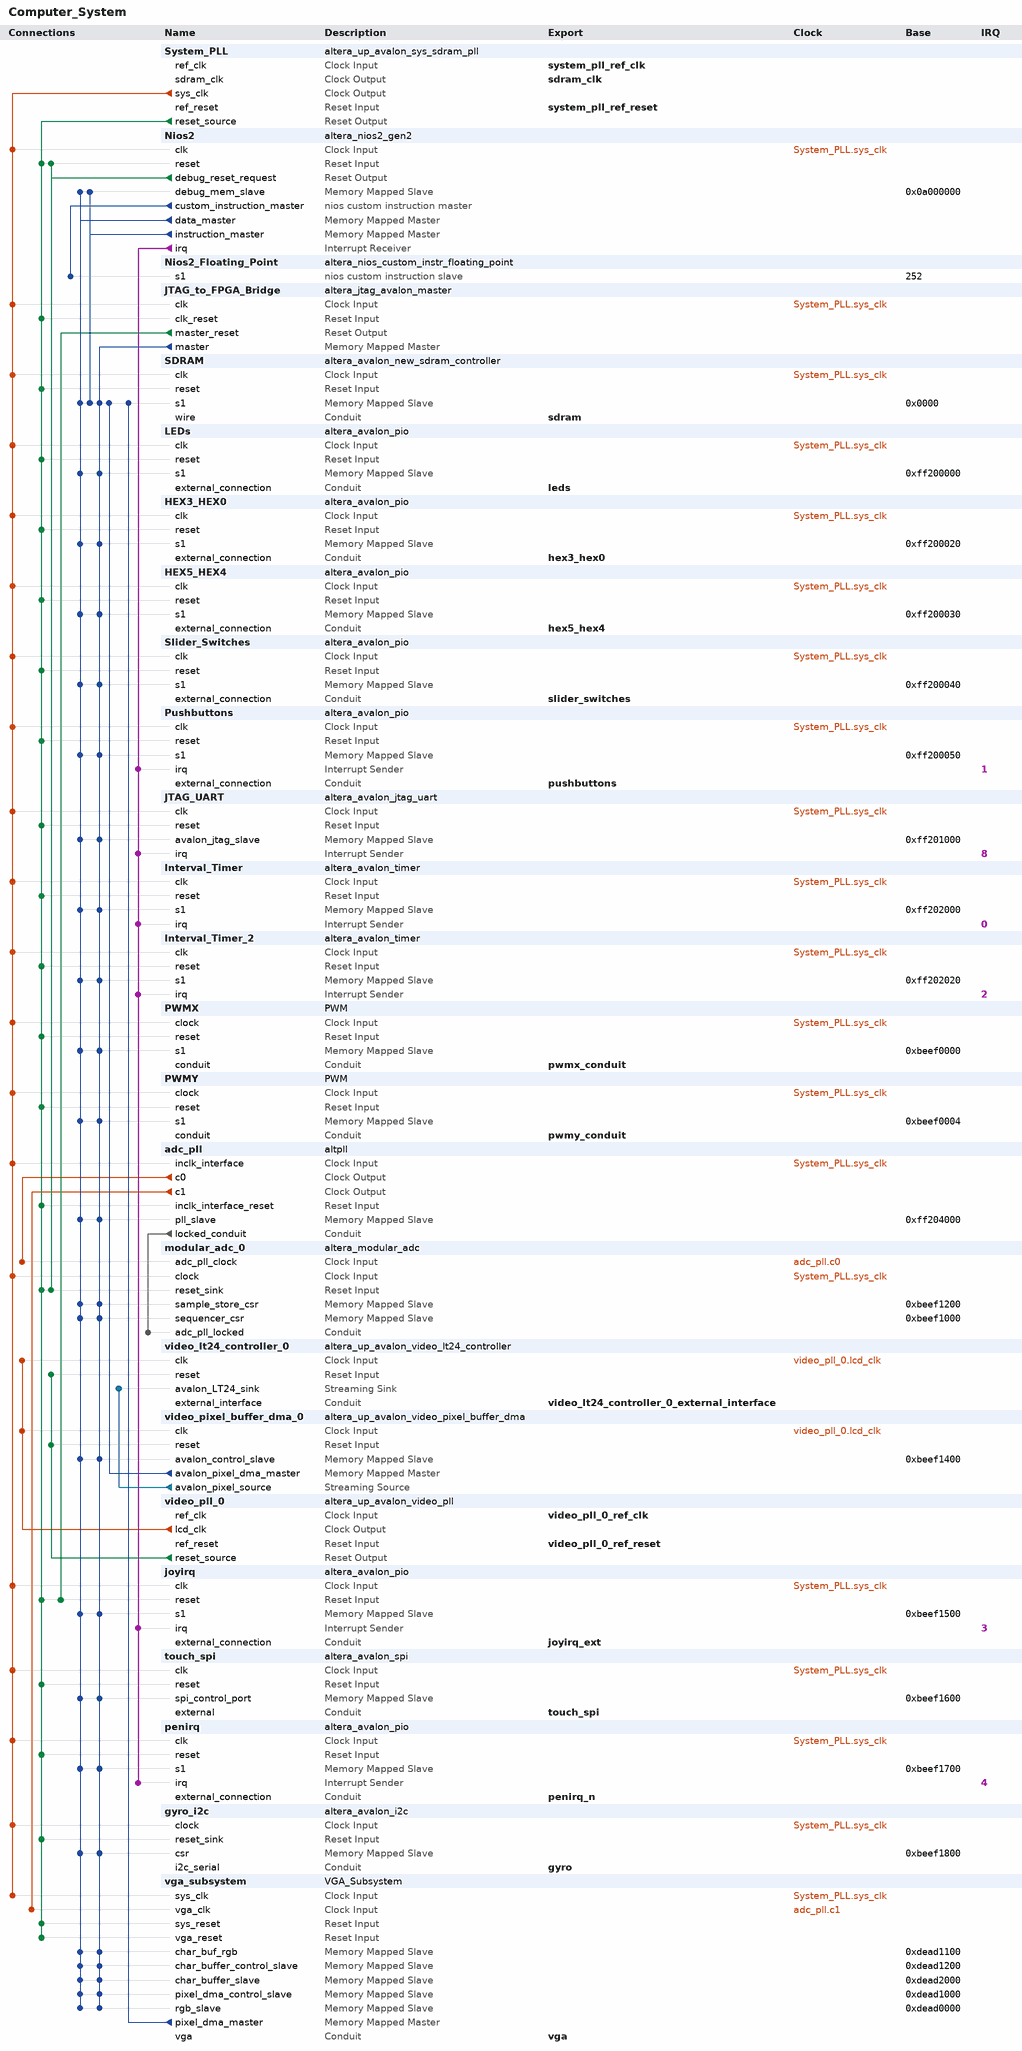
[diagram p0: system contents]
# Platform Designer (Qsys) system Computer_System, MAX 10 10M50DAF484C7G
# Parameters at their usual value, and those the tool derives, are not listed.
package require -exact qsys 18.1
create_system Computer_System
set_project_property DEVICE_FAMILY {MAX 10}
set_project_property DEVICE 10M50DAF484C7G

add_instance System_PLL altera_up_avalon_sys_sdram_pll 18.0
set_instance_parameter_value System_PLL CV_boards DE10-Standard
set_instance_parameter_value System_PLL gui_outclk 100.0
set_instance_parameter_value System_PLL gui_refclk 50.0

add_instance Nios2 altera_nios2_gen2 18.1
set_instance_parameter_value Nios2 dcache_size 0
set_instance_parameter_value Nios2 debug_datatrigger 2
set_instance_parameter_value Nios2 debug_hwbreakpoint 2
set_instance_parameter_value Nios2 debug_traceType instruction_trace
set_instance_parameter_value Nios2 dividerType srt2
set_instance_parameter_value Nios2 exceptionSlave SDRAM.s1
set_instance_parameter_value Nios2 icache_size 4096
set_instance_parameter_value Nios2 impl Tiny
set_instance_parameter_value Nios2 mul_64_impl 1
set_instance_parameter_value Nios2 mul_shift_choice 1
set_instance_parameter_value Nios2 resetSlave SDRAM.s1
set_instance_parameter_value Nios2 resetrequest_enabled false
set_instance_parameter_value Nios2 setting_support31bitdcachebypass false

add_instance Nios2_Floating_Point altera_nios_custom_instr_floating_point 18.1

add_instance JTAG_to_FPGA_Bridge altera_jtag_avalon_master 18.1

add_instance SDRAM altera_avalon_new_sdram_controller 18.1
set_instance_parameter_value SDRAM TAC 5.5
set_instance_parameter_value SDRAM TRCD 20.0
set_instance_parameter_value SDRAM TRP 20.0
set_instance_parameter_value SDRAM casLatency 3
set_instance_parameter_value SDRAM columnWidth 10
set_instance_parameter_value SDRAM dataWidth 16
set_instance_parameter_value SDRAM generateSimulationModel true
set_instance_parameter_value SDRAM model single_Micron_MT48LC4M32B2_7_chip
set_instance_parameter_value SDRAM numberOfBanks 4
set_instance_parameter_value SDRAM numberOfChipSelects 1
set_instance_parameter_value SDRAM powerUpDelay 100.0
set_instance_parameter_value SDRAM refreshPeriod 15.625
set_instance_parameter_value SDRAM rowWidth 13

add_instance LEDs altera_avalon_pio 18.1
set_instance_parameter_value LEDs direction Output
set_instance_parameter_value LEDs width 10

add_instance HEX3_HEX0 altera_avalon_pio 18.1
set_instance_parameter_value HEX3_HEX0 direction Output
set_instance_parameter_value HEX3_HEX0 width 32

add_instance HEX5_HEX4 altera_avalon_pio 18.1
set_instance_parameter_value HEX5_HEX4 direction Output
set_instance_parameter_value HEX5_HEX4 width 16

add_instance Slider_Switches altera_avalon_pio 18.1
set_instance_parameter_value Slider_Switches direction Input
set_instance_parameter_value Slider_Switches simDoTestBenchWiring true
set_instance_parameter_value Slider_Switches width 10

add_instance Pushbuttons altera_avalon_pio 18.1
set_instance_parameter_value Pushbuttons bitClearingEdgeCapReg true
set_instance_parameter_value Pushbuttons captureEdge true
set_instance_parameter_value Pushbuttons direction Input
set_instance_parameter_value Pushbuttons edgeType FALLING
set_instance_parameter_value Pushbuttons generateIRQ true
set_instance_parameter_value Pushbuttons irqType EDGE
set_instance_parameter_value Pushbuttons simDoTestBenchWiring true
set_instance_parameter_value Pushbuttons width 2

add_instance JTAG_UART altera_avalon_jtag_uart 18.1
set_instance_parameter_value JTAG_UART simInteractiveOptions NO_INTERACTIVE_WINDOWS

add_instance Interval_Timer altera_avalon_timer 18.1
set_instance_parameter_value Interval_Timer period 125.0
set_instance_parameter_value Interval_Timer periodUnits MSEC

add_instance Interval_Timer_2 altera_avalon_timer 18.1
set_instance_parameter_value Interval_Timer_2 period 125.0
set_instance_parameter_value Interval_Timer_2 periodUnits MSEC

add_instance PWMX PWM 1.0

add_instance PWMY PWM 1.0

add_instance adc_pll altpll 18.1
set_instance_parameter_value adc_pll CLK0_DIVIDE_BY 10
set_instance_parameter_value adc_pll CLK0_MULTIPLY_BY 1
set_instance_parameter_value adc_pll CLK1_DIVIDE_BY 4
set_instance_parameter_value adc_pll CLK1_DUTY_CYCLE 50
set_instance_parameter_value adc_pll CLK1_MULTIPLY_BY 1
set_instance_parameter_value adc_pll CLK1_PHASE_SHIFT 0
set_instance_parameter_value adc_pll INCLK0_INPUT_FREQUENCY 10000
set_instance_parameter_value adc_pll PORT_ARESET PORT_UNUSED
set_instance_parameter_value adc_pll PORT_LOCKED PORT_USED
set_instance_parameter_value adc_pll PORT_clk1 PORT_USED
set_instance_parameter_value adc_pll PORT_clk2 PORT_UNUSED
set_instance_parameter_value adc_pll PORT_clk3 PORT_UNUSED

add_instance modular_adc_0 altera_modular_adc 18.1
set_instance_parameter_value modular_adc_0 CLOCK_FREQ 100000000
set_instance_parameter_value modular_adc_0 CORE_VAR 0
set_instance_parameter_value modular_adc_0 DEVICE_PART 10M50DAF484C7G
set_instance_parameter_value modular_adc_0 clkdiv 2
set_instance_parameter_value modular_adc_0 int_vref_vr 3.0
set_instance_parameter_value modular_adc_0 refsel 0
set_instance_parameter_value modular_adc_0 sample_rate 0
set_instance_parameter_value modular_adc_0 seq_order_length 2
set_instance_parameter_value modular_adc_0 seq_order_slot_1 4
set_instance_parameter_value modular_adc_0 seq_order_slot_2 5
set_instance_parameter_value modular_adc_0 seq_order_slot_3 30
set_instance_parameter_value modular_adc_0 seq_order_slot_4 30
set_instance_parameter_value modular_adc_0 seq_order_slot_5 30
set_instance_parameter_value modular_adc_0 seq_order_slot_6 30
set_instance_parameter_value modular_adc_0 seq_order_slot_7 30
set_instance_parameter_value modular_adc_0 use_ch0 false
set_instance_parameter_value modular_adc_0 use_ch1 false
set_instance_parameter_value modular_adc_0 use_ch2 false
set_instance_parameter_value modular_adc_0 use_ch3 false
set_instance_parameter_value modular_adc_0 use_ch4 true
set_instance_parameter_value modular_adc_0 use_ch5 true
set_instance_parameter_value modular_adc_0 use_ch6 false
set_instance_parameter_value modular_adc_0 use_ch7 false
set_instance_parameter_value modular_adc_0 use_ch8 false
set_instance_parameter_value modular_adc_0 use_tsd false

add_instance video_lt24_controller_0 altera_up_avalon_video_lt24_controller 18.0

add_instance video_pixel_buffer_dma_0 altera_up_avalon_video_pixel_buffer_dma 18.0
set_instance_parameter_value video_pixel_buffer_dma_0 addr_mode Consecutive
set_instance_parameter_value video_pixel_buffer_dma_0 back_start_address 66060288
set_instance_parameter_value video_pixel_buffer_dma_0 color_space {16-bit RGB}
set_instance_parameter_value video_pixel_buffer_dma_0 image_height 240
set_instance_parameter_value video_pixel_buffer_dma_0 image_width 320
set_instance_parameter_value video_pixel_buffer_dma_0 start_address 66060288

add_instance video_pll_0 altera_up_avalon_video_pll 18.0
set_instance_parameter_value video_pll_0 camera {5MP Digital Camera (THDB_D5M)}
set_instance_parameter_value video_pll_0 gui_refclk 50.0
set_instance_parameter_value video_pll_0 lcd {2.4" LCD on LT24}
set_instance_parameter_value video_pll_0 lcd_clk_en true
set_instance_parameter_value video_pll_0 vga_clk_en false

add_instance joyirq altera_avalon_pio 18.1
set_instance_parameter_value joyirq bitClearingEdgeCapReg true
set_instance_parameter_value joyirq captureEdge true
set_instance_parameter_value joyirq direction Input
set_instance_parameter_value joyirq edgeType FALLING
set_instance_parameter_value joyirq generateIRQ true
set_instance_parameter_value joyirq irqType EDGE
set_instance_parameter_value joyirq width 1

add_instance touch_spi altera_avalon_spi 18.1
set_instance_parameter_value touch_spi clockPolarity 0
set_instance_parameter_value touch_spi dataWidth 8
set_instance_parameter_value touch_spi masterSPI true
set_instance_parameter_value touch_spi numberOfSlaves 1
set_instance_parameter_value touch_spi targetClockRate 128000

add_instance penirq altera_avalon_pio 18.1
set_instance_parameter_value penirq bitClearingEdgeCapReg true
set_instance_parameter_value penirq captureEdge true
set_instance_parameter_value penirq direction Input
set_instance_parameter_value penirq edgeType FALLING
set_instance_parameter_value penirq generateIRQ true
set_instance_parameter_value penirq irqType EDGE
set_instance_parameter_value penirq width 1

add_instance gyro_i2c altera_avalon_i2c 18.1
set_instance_parameter_value gyro_i2c FIFO_DEPTH 4

add_instance vga_subsystem VGA_Subsystem 1.0

# connections
add_connection adc_pll.c0 modular_adc_0.adc_pll_clock clock
add_connection adc_pll.c1 vga_subsystem.vga_clk clock
add_connection System_PLL.sys_clk adc_pll.inclk_interface clock
add_connection System_PLL.sys_clk gyro_i2c.clock clock
add_connection System_PLL.sys_clk HEX3_HEX0.clk clock
add_connection System_PLL.sys_clk HEX5_HEX4.clk clock
add_connection System_PLL.sys_clk Interval_Timer.clk clock
add_connection System_PLL.sys_clk Interval_Timer_2.clk clock
add_connection System_PLL.sys_clk joyirq.clk clock
add_connection System_PLL.sys_clk JTAG_to_FPGA_Bridge.clk clock
add_connection System_PLL.sys_clk JTAG_UART.clk clock
add_connection System_PLL.sys_clk LEDs.clk clock
add_connection System_PLL.sys_clk modular_adc_0.clock clock
add_connection System_PLL.sys_clk Nios2.clk clock
add_connection System_PLL.sys_clk penirq.clk clock
add_connection System_PLL.sys_clk Pushbuttons.clk clock
add_connection System_PLL.sys_clk PWMX.clock clock
add_connection System_PLL.sys_clk PWMY.clock clock
add_connection System_PLL.sys_clk SDRAM.clk clock
add_connection System_PLL.sys_clk Slider_Switches.clk clock
add_connection System_PLL.sys_clk touch_spi.clk clock
add_connection System_PLL.sys_clk vga_subsystem.sys_clk clock
add_connection video_pll_0.lcd_clk video_lt24_controller_0.clk clock
add_connection video_pll_0.lcd_clk video_pixel_buffer_dma_0.clk clock
add_connection JTAG_to_FPGA_Bridge.master_reset joyirq.reset reset
add_connection Nios2.debug_reset_request modular_adc_0.reset_sink reset
add_connection Nios2.debug_reset_request Nios2.reset reset
add_connection System_PLL.reset_source adc_pll.inclk_interface_reset reset
add_connection System_PLL.reset_source gyro_i2c.reset_sink reset
add_connection System_PLL.reset_source HEX3_HEX0.reset reset
add_connection System_PLL.reset_source HEX5_HEX4.reset reset
add_connection System_PLL.reset_source Interval_Timer.reset reset
add_connection System_PLL.reset_source Interval_Timer_2.reset reset
add_connection System_PLL.reset_source joyirq.reset reset
add_connection System_PLL.reset_source JTAG_to_FPGA_Bridge.clk_reset reset
add_connection System_PLL.reset_source JTAG_UART.reset reset
add_connection System_PLL.reset_source LEDs.reset reset
add_connection System_PLL.reset_source modular_adc_0.reset_sink reset
add_connection System_PLL.reset_source Nios2.reset reset
add_connection System_PLL.reset_source penirq.reset reset
add_connection System_PLL.reset_source Pushbuttons.reset reset
add_connection System_PLL.reset_source PWMX.reset reset
add_connection System_PLL.reset_source PWMY.reset reset
add_connection System_PLL.reset_source SDRAM.reset reset
add_connection System_PLL.reset_source Slider_Switches.reset reset
add_connection System_PLL.reset_source touch_spi.reset reset
add_connection System_PLL.reset_source vga_subsystem.sys_reset reset
add_connection System_PLL.reset_source vga_subsystem.vga_reset reset
add_connection video_pll_0.reset_source video_lt24_controller_0.reset reset
add_connection video_pll_0.reset_source video_pixel_buffer_dma_0.reset reset
add_connection JTAG_to_FPGA_Bridge.master adc_pll.pll_slave avalon
set_connection_parameter_value JTAG_to_FPGA_Bridge.master/adc_pll.pll_slave baseAddress 0xff204000
add_connection JTAG_to_FPGA_Bridge.master gyro_i2c.csr avalon
set_connection_parameter_value JTAG_to_FPGA_Bridge.master/gyro_i2c.csr baseAddress 0xbeef1800
add_connection JTAG_to_FPGA_Bridge.master HEX3_HEX0.s1 avalon
set_connection_parameter_value JTAG_to_FPGA_Bridge.master/HEX3_HEX0.s1 baseAddress 0xff200020
add_connection JTAG_to_FPGA_Bridge.master HEX5_HEX4.s1 avalon
set_connection_parameter_value JTAG_to_FPGA_Bridge.master/HEX5_HEX4.s1 baseAddress 0xff200030
add_connection JTAG_to_FPGA_Bridge.master Interval_Timer.s1 avalon
set_connection_parameter_value JTAG_to_FPGA_Bridge.master/Interval_Timer.s1 baseAddress 0xff202000
add_connection JTAG_to_FPGA_Bridge.master Interval_Timer_2.s1 avalon
set_connection_parameter_value JTAG_to_FPGA_Bridge.master/Interval_Timer_2.s1 baseAddress 0xff202020
add_connection JTAG_to_FPGA_Bridge.master joyirq.s1 avalon
set_connection_parameter_value JTAG_to_FPGA_Bridge.master/joyirq.s1 baseAddress 0xbeef1500
add_connection JTAG_to_FPGA_Bridge.master JTAG_UART.avalon_jtag_slave avalon
set_connection_parameter_value JTAG_to_FPGA_Bridge.master/JTAG_UART.avalon_jtag_slave baseAddress 0xff201000
add_connection JTAG_to_FPGA_Bridge.master LEDs.s1 avalon
set_connection_parameter_value JTAG_to_FPGA_Bridge.master/LEDs.s1 baseAddress 0xff200000
add_connection JTAG_to_FPGA_Bridge.master modular_adc_0.sample_store_csr avalon
set_connection_parameter_value JTAG_to_FPGA_Bridge.master/modular_adc_0.sample_store_csr baseAddress 0xbeef1200
add_connection JTAG_to_FPGA_Bridge.master modular_adc_0.sequencer_csr avalon
set_connection_parameter_value JTAG_to_FPGA_Bridge.master/modular_adc_0.sequencer_csr baseAddress 0xbeef1000
add_connection JTAG_to_FPGA_Bridge.master penirq.s1 avalon
set_connection_parameter_value JTAG_to_FPGA_Bridge.master/penirq.s1 baseAddress 0xbeef1700
add_connection JTAG_to_FPGA_Bridge.master Pushbuttons.s1 avalon
set_connection_parameter_value JTAG_to_FPGA_Bridge.master/Pushbuttons.s1 baseAddress 0xff200050
add_connection JTAG_to_FPGA_Bridge.master PWMX.s1 avalon
set_connection_parameter_value JTAG_to_FPGA_Bridge.master/PWMX.s1 baseAddress 0xbeef0000
add_connection JTAG_to_FPGA_Bridge.master PWMY.s1 avalon
set_connection_parameter_value JTAG_to_FPGA_Bridge.master/PWMY.s1 baseAddress 0xbeef0004
add_connection JTAG_to_FPGA_Bridge.master SDRAM.s1 avalon
set_connection_parameter_value JTAG_to_FPGA_Bridge.master/SDRAM.s1 baseAddress 0x0000
add_connection JTAG_to_FPGA_Bridge.master Slider_Switches.s1 avalon
set_connection_parameter_value JTAG_to_FPGA_Bridge.master/Slider_Switches.s1 baseAddress 0xff200040
add_connection JTAG_to_FPGA_Bridge.master touch_spi.spi_control_port avalon
set_connection_parameter_value JTAG_to_FPGA_Bridge.master/touch_spi.spi_control_port baseAddress 0xbeef1600
add_connection JTAG_to_FPGA_Bridge.master vga_subsystem.char_buf_rgb avalon
set_connection_parameter_value JTAG_to_FPGA_Bridge.master/vga_subsystem.char_buf_rgb baseAddress 0xdead1100
add_connection JTAG_to_FPGA_Bridge.master vga_subsystem.char_buffer_control_slave avalon
set_connection_parameter_value JTAG_to_FPGA_Bridge.master/vga_subsystem.char_buffer_control_slave baseAddress 0xdead1200
add_connection JTAG_to_FPGA_Bridge.master vga_subsystem.char_buffer_slave avalon
set_connection_parameter_value JTAG_to_FPGA_Bridge.master/vga_subsystem.char_buffer_slave baseAddress 0xdead2000
add_connection JTAG_to_FPGA_Bridge.master vga_subsystem.pixel_dma_control_slave avalon
set_connection_parameter_value JTAG_to_FPGA_Bridge.master/vga_subsystem.pixel_dma_control_slave baseAddress 0xdead1000
add_connection JTAG_to_FPGA_Bridge.master vga_subsystem.rgb_slave avalon
set_connection_parameter_value JTAG_to_FPGA_Bridge.master/vga_subsystem.rgb_slave baseAddress 0xdead0000
add_connection JTAG_to_FPGA_Bridge.master video_pixel_buffer_dma_0.avalon_control_slave avalon
set_connection_parameter_value JTAG_to_FPGA_Bridge.master/video_pixel_buffer_dma_0.avalon_control_slave baseAddress 0xbeef1400
add_connection Nios2.data_master adc_pll.pll_slave avalon
set_connection_parameter_value Nios2.data_master/adc_pll.pll_slave baseAddress 0xff204000
add_connection Nios2.data_master gyro_i2c.csr avalon
set_connection_parameter_value Nios2.data_master/gyro_i2c.csr baseAddress 0xbeef1800
add_connection Nios2.data_master HEX3_HEX0.s1 avalon
set_connection_parameter_value Nios2.data_master/HEX3_HEX0.s1 baseAddress 0xff200020
add_connection Nios2.data_master HEX5_HEX4.s1 avalon
set_connection_parameter_value Nios2.data_master/HEX5_HEX4.s1 baseAddress 0xff200030
add_connection Nios2.data_master Interval_Timer.s1 avalon
set_connection_parameter_value Nios2.data_master/Interval_Timer.s1 baseAddress 0xff202000
add_connection Nios2.data_master Interval_Timer_2.s1 avalon
set_connection_parameter_value Nios2.data_master/Interval_Timer_2.s1 baseAddress 0xff202020
add_connection Nios2.data_master joyirq.s1 avalon
set_connection_parameter_value Nios2.data_master/joyirq.s1 baseAddress 0xbeef1500
add_connection Nios2.data_master JTAG_UART.avalon_jtag_slave avalon
set_connection_parameter_value Nios2.data_master/JTAG_UART.avalon_jtag_slave baseAddress 0xff201000
add_connection Nios2.data_master LEDs.s1 avalon
set_connection_parameter_value Nios2.data_master/LEDs.s1 baseAddress 0xff200000
add_connection Nios2.data_master modular_adc_0.sample_store_csr avalon
set_connection_parameter_value Nios2.data_master/modular_adc_0.sample_store_csr baseAddress 0xbeef1200
add_connection Nios2.data_master modular_adc_0.sequencer_csr avalon
set_connection_parameter_value Nios2.data_master/modular_adc_0.sequencer_csr baseAddress 0xbeef1000
add_connection Nios2.data_master Nios2.debug_mem_slave avalon
set_connection_parameter_value Nios2.data_master/Nios2.debug_mem_slave baseAddress 0x0a000000
add_connection Nios2.data_master penirq.s1 avalon
set_connection_parameter_value Nios2.data_master/penirq.s1 baseAddress 0xbeef1700
add_connection Nios2.data_master Pushbuttons.s1 avalon
set_connection_parameter_value Nios2.data_master/Pushbuttons.s1 baseAddress 0xff200050
add_connection Nios2.data_master PWMX.s1 avalon
set_connection_parameter_value Nios2.data_master/PWMX.s1 baseAddress 0xbeef0000
add_connection Nios2.data_master PWMY.s1 avalon
set_connection_parameter_value Nios2.data_master/PWMY.s1 baseAddress 0xbeef0004
add_connection Nios2.data_master SDRAM.s1 avalon
set_connection_parameter_value Nios2.data_master/SDRAM.s1 baseAddress 0x0000
add_connection Nios2.data_master Slider_Switches.s1 avalon
set_connection_parameter_value Nios2.data_master/Slider_Switches.s1 baseAddress 0xff200040
add_connection Nios2.data_master touch_spi.spi_control_port avalon
set_connection_parameter_value Nios2.data_master/touch_spi.spi_control_port baseAddress 0xbeef1600
add_connection Nios2.data_master vga_subsystem.char_buf_rgb avalon
set_connection_parameter_value Nios2.data_master/vga_subsystem.char_buf_rgb baseAddress 0xdead1100
add_connection Nios2.data_master vga_subsystem.char_buffer_control_slave avalon
set_connection_parameter_value Nios2.data_master/vga_subsystem.char_buffer_control_slave baseAddress 0xdead1200
add_connection Nios2.data_master vga_subsystem.char_buffer_slave avalon
set_connection_parameter_value Nios2.data_master/vga_subsystem.char_buffer_slave baseAddress 0xdead2000
add_connection Nios2.data_master vga_subsystem.pixel_dma_control_slave avalon
set_connection_parameter_value Nios2.data_master/vga_subsystem.pixel_dma_control_slave baseAddress 0xdead1000
add_connection Nios2.data_master vga_subsystem.rgb_slave avalon
set_connection_parameter_value Nios2.data_master/vga_subsystem.rgb_slave baseAddress 0xdead0000
add_connection Nios2.data_master video_pixel_buffer_dma_0.avalon_control_slave avalon
set_connection_parameter_value Nios2.data_master/video_pixel_buffer_dma_0.avalon_control_slave baseAddress 0xbeef1400
add_connection Nios2.instruction_master Nios2.debug_mem_slave avalon
set_connection_parameter_value Nios2.instruction_master/Nios2.debug_mem_slave baseAddress 0x0a000000
add_connection Nios2.instruction_master SDRAM.s1 avalon
set_connection_parameter_value Nios2.instruction_master/SDRAM.s1 baseAddress 0x0000
add_connection vga_subsystem.pixel_dma_master SDRAM.s1 avalon
set_connection_parameter_value vga_subsystem.pixel_dma_master/SDRAM.s1 baseAddress 0x0000
add_connection video_pixel_buffer_dma_0.avalon_pixel_dma_master SDRAM.s1 avalon
set_connection_parameter_value video_pixel_buffer_dma_0.avalon_pixel_dma_master/SDRAM.s1 baseAddress 0x0000
add_connection video_pixel_buffer_dma_0.avalon_pixel_source video_lt24_controller_0.avalon_LT24_sink avalon_streaming
add_connection adc_pll.locked_conduit modular_adc_0.adc_pll_locked conduit
add_connection Nios2.irq Interval_Timer.irq interrupt
set_connection_parameter_value Nios2.irq/Interval_Timer.irq irqNumber 0
add_connection Nios2.irq Interval_Timer_2.irq interrupt
set_connection_parameter_value Nios2.irq/Interval_Timer_2.irq irqNumber 2
add_connection Nios2.irq joyirq.irq interrupt
set_connection_parameter_value Nios2.irq/joyirq.irq irqNumber 3
add_connection Nios2.irq JTAG_UART.irq interrupt
set_connection_parameter_value Nios2.irq/JTAG_UART.irq irqNumber 8
add_connection Nios2.irq penirq.irq interrupt
set_connection_parameter_value Nios2.irq/penirq.irq irqNumber 4
add_connection Nios2.irq Pushbuttons.irq interrupt
set_connection_parameter_value Nios2.irq/Pushbuttons.irq irqNumber 1
add_connection Nios2.custom_instruction_master Nios2_Floating_Point.s1 nios_custom_instruction
set_connection_parameter_value Nios2.custom_instruction_master/Nios2_Floating_Point.s1 CIName nios2_floating_point
set_connection_parameter_value Nios2.custom_instruction_master/Nios2_Floating_Point.s1 baseAddress 252

# exported interfaces
add_interface gyro conduit end
set_interface_property gyro EXPORT_OF gyro_i2c.i2c_serial
add_interface hex3_hex0 conduit end
set_interface_property hex3_hex0 EXPORT_OF HEX3_HEX0.external_connection
add_interface hex5_hex4 conduit end
set_interface_property hex5_hex4 EXPORT_OF HEX5_HEX4.external_connection
add_interface joyirq_ext conduit end
set_interface_property joyirq_ext EXPORT_OF joyirq.external_connection
add_interface leds conduit end
set_interface_property leds EXPORT_OF LEDs.external_connection
add_interface penirq_n conduit end
set_interface_property penirq_n EXPORT_OF penirq.external_connection
add_interface pushbuttons conduit end
set_interface_property pushbuttons EXPORT_OF Pushbuttons.external_connection
add_interface pwmx_conduit conduit end
set_interface_property pwmx_conduit EXPORT_OF PWMX.conduit
add_interface pwmy_conduit conduit end
set_interface_property pwmy_conduit EXPORT_OF PWMY.conduit
add_interface sdram conduit end
set_interface_property sdram EXPORT_OF SDRAM.wire
add_interface sdram_clk clock source
set_interface_property sdram_clk EXPORT_OF System_PLL.sdram_clk
add_interface slider_switches conduit end
set_interface_property slider_switches EXPORT_OF Slider_Switches.external_connection
add_interface system_pll_ref_clk clock sink
set_interface_property system_pll_ref_clk EXPORT_OF System_PLL.ref_clk
add_interface system_pll_ref_reset reset sink
set_interface_property system_pll_ref_reset EXPORT_OF System_PLL.ref_reset
add_interface touch_spi conduit end
set_interface_property touch_spi EXPORT_OF touch_spi.external
add_interface vga conduit end
set_interface_property vga EXPORT_OF vga_subsystem.vga
add_interface video_lt24_controller_0_external_interface conduit end
set_interface_property video_lt24_controller_0_external_interface EXPORT_OF video_lt24_controller_0.external_interface
add_interface video_pll_0_ref_clk clock sink
set_interface_property video_pll_0_ref_clk EXPORT_OF video_pll_0.ref_clk
add_interface video_pll_0_ref_reset reset sink
set_interface_property video_pll_0_ref_reset EXPORT_OF video_pll_0.ref_reset

set_interconnect_requirement {$system} qsys_mm.clockCrossingAdapter HANDSHAKE
set_interconnect_requirement {$system} qsys_mm.enableEccProtection FALSE
set_interconnect_requirement {$system} qsys_mm.insertDefaultSlave FALSE
set_interconnect_requirement {$system} qsys_mm.maxAdditionalLatency 1

save_system Computer_System.qsys
